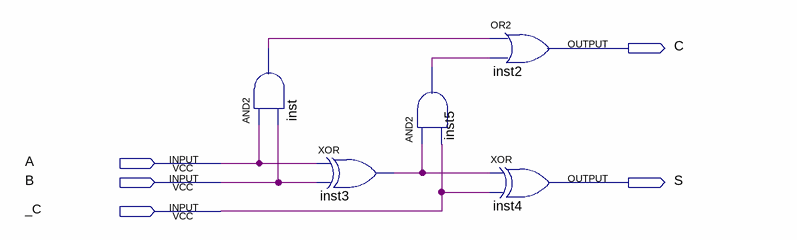
[diagram p0: schematic sheet]
// Quartus schematic ham_FA.bdf as structural Verilog: 5 symbols, 5 pins
module ham_FA (
  input  A,
  input  B,
  input  _C,
  output C,
  output S
);

  wire inst3_out, inst5_out, inst_out;

  and inst (inst_out, A, B);
  xor inst3 (inst3_out, A, B);
  and inst5 (inst5_out, inst3_out, _C);
  or inst2 (C, inst_out, inst5_out);
  xor inst4 (S, inst3_out, _C);
endmodule
